# EAGLE design zinko (EAGLE 9.3.0)
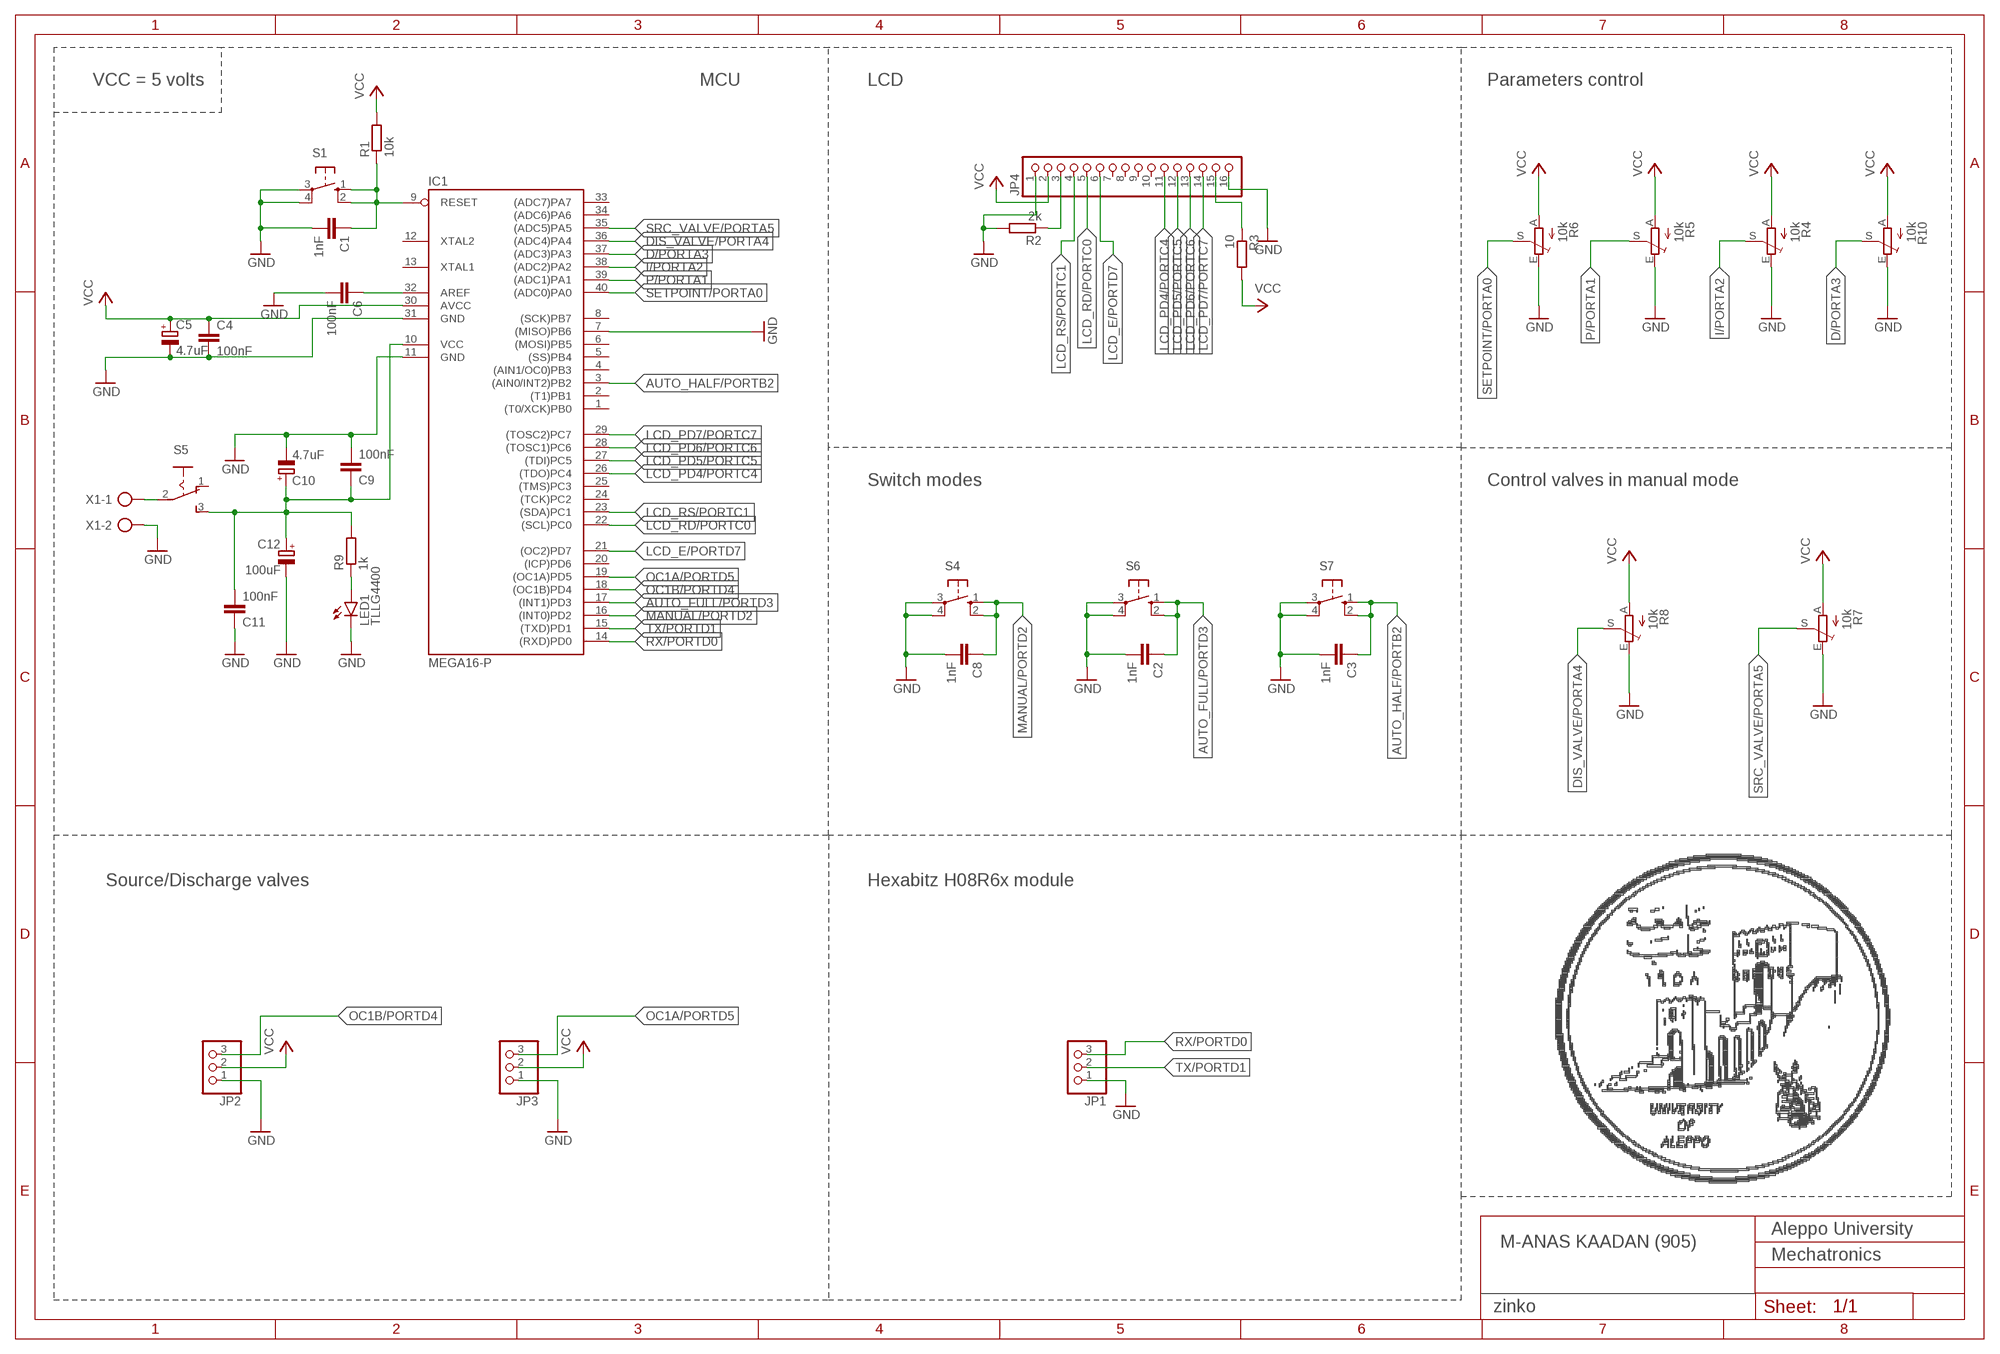
[diagram p0: schematic, sheet 1]

## Parts
C1  1nF  C-EU025-024X044  [C025-024X044]
C2  1nF  C-EU025-024X044  [C025-024X044]
C3  1nF  C-EU025-024X044  [C025-024X044]
C4  100nF  C-EU025-024X044  [C025-024X044]
C5  4.7uF  CPOL-EUE2,5-6E  [E2,5-6E]
C6  100nF  C-EU025-024X044  [C025-024X044]
C8  1nF  C-EU025-024X044  [C025-024X044]
C9  100nF  C-EU025-024X044  [C025-024X044]
C10  4.7uF  CPOL-EUB45181A  [B45181A]
C11  100nF  C-EU025-024X044  [C025-024X044]
C12  100uF  CPOL-EUB45181A  [B45181A]
IC1  MEGA16-P  [DIL40]
JP1  PINHD-1X3  [1X03]
JP2  PINHD-1X3  [1X03]
JP3  PINHD-1X3  [1X03]
JP4  PINHD-1X16  [1X16]
LED1  TLLG4400  [LED3MM]
R1  10k  R-EU_0204/7  [0204/7]
R2  2k  R-EU_0204/7  [0204/7]
R3  10  R-EU_0204/7  [0204/7]
R4  10k  TRIM_EU-RJ9W  [RJ9W]
R5  10k  TRIM_EU-RJ9W  [RJ9W]
R6  10k  TRIM_EU-RJ9W  [RJ9W]
R7  10k  TRIM_EU-RJ9W  [RJ9W]
R8  10k  TRIM_EU-RJ9W  [RJ9W]
R9  1k  R-EU_0204/7  [0204/7]
R10  10k  TRIM_EU-RJ9W  [RJ9W]
S1  10-XX  [B3F-10XX]
S4  10-XX  [B3F-10XX]
S5  255SB  [255SB]
S6  10-XX  [B3F-10XX]
S7  10-XX  [B3F-10XX]
X1  AK300/2  [AK300/2]

## Nets
AUTO_FULL/PORTD3: C2.1 IC1.17((INT1)PD3) S6.1(S) S6.2(S1)
AUTO_HALF/PORTB2: C3.1 IC1.3((AIN0/INT2)PB2) S7.1(S) S7.2(S1)
D/PORTA3: IC1.37((ADC3)PA3) R10.S
DIS_VALVE/PORTA4: IC1.36((ADC4)PA4) R8.S
GND: C1.2 C2.2 C3.2 C4.2 C5.- C6.2 C8.2 C9.2 C10.- C11.1 C12.- IC1.7((MISO)PB6) IC1.11(GND) IC1.31(GND) JP1.1 JP2.1 JP3.1 JP4.1 JP4.16 LED1.K(C) R2.2 R4.E R5.E R6.E R7.E R8.E R10.E S1.3(P) S1.4(P1) S4.3(P) S4.4(P1) S6.3(P) S6.4(P1) S7.3(P) S7.4(P1) X1.2
I/PORTA2: IC1.38((ADC2)PA2) R4.S
LCD_E/PORTD7: IC1.21((OC2)PD7) JP4.6
LCD_PD4/PORTC4: IC1.26((TDO)PC4) JP4.11
LCD_PD5/PORTC5: IC1.27((TDI)PC5) JP4.12
LCD_PD6/PORTC6: IC1.28((TOSC1)PC6) JP4.13
LCD_PD7/PORTC7: IC1.29((TOSC2)PC7) JP4.14
LCD_RD/PORTC0: IC1.22((SCL)PC0) JP4.5
LCD_RS/PORTC1: IC1.23((SDA)PC1) JP4.4
MANUAL/PORTD2: C8.1 IC1.16((INT0)PD2) S4.1(S) S4.2(S1)
N$1: C1.1 IC1.9(RESET) R1.1 S1.1(S) S1.2(S1)
N$2: JP4.15 R3.1
N$3: C6.1 IC1.32(AREF)
N$4: JP4.3 R2.1
N$26: S5.2(P) X1.1
N$28: LED1.A R9.1
OC1A/PORTD5: IC1.19((OC1A)PD5) JP3.3
OC1B/PORTD4: IC1.18((OC1B)PD4) JP2.3
P/PORTA1: IC1.39((ADC1)PA1) R5.S
RX/PORTD0: IC1.14((RXD)PD0) JP1.3
SETPOINT/PORTA0: IC1.40((ADC0)PA0) R6.S
SRC_VALVE/PORTA5: IC1.35((ADC5)PA5) R7.S
TX/PORTD1: IC1.15((TXD)PD1) JP1.2
VCC: C4.1 C5.+ C9.1 C10.+ C11.2 C12.+ IC1.10(VCC) IC1.30(AVCC) JP2.2 JP3.2 JP4.2 R1.2 R3.2 R4.A R5.A R6.A R7.A R8.A R9.2 R10.A S5.3(S)
Unconnected: IC1.1((T0/XCK)PB0) IC1.2((T1)PB1) IC1.4((AIN1/OC0)PB3) IC1.5((SS)PB4) IC1.6((MOSI)PB5) IC1.8((SCK)PB7) IC1.12(XTAL2) IC1.13(XTAL1) IC1.20((ICP)PD6) IC1.24((TCK)PC2) IC1.25((TMS)PC3) IC1.33((ADC7)PA7) IC1.34((ADC6)PA6) JP4.7 JP4.8 JP4.9 JP4.10 S5.1(O)

## Notes on the sheet
- VCC = 5 volts | MCU | LCD | Parameters control
- Switch modes | Control valves in manual mode
- Source/Discharge valves | Hexabitz H08R6x module
- Aleppo University
- M-ANAS KAADAN (905)
- Mechatronics

## Library data of the parts
C1-C4 C6 C8 = rcl:C-EU: CAPACITOR, European symbol; SPICEPREFIX: C
C5 = rcl:CPOL-EU: POLARIZED CAPACITOR, European symbol; SPICEPREFIX: C
C9 C11 = rcl@1:C-EU: CAPACITOR, European symbol
C10 C12 = rcl@1:CPOL-EU: POLARIZED CAPACITOR, European symbol
IC1 = atmel:MEGA16-P: MICROCONTROLLER 16 Kbytes FLASH 1 kbytes SRAM 512 bytes EEPROM USART 8-channel 10 bit ADC Source: avr.lbr; MPN: ATMEGA16-16PU; OC_FARNELL: 9171142; OC_NEWARK: 01M6885
JP1-JP3 = pinhead:PINHD-1X3: PIN HEADER
JP4 = pinhead:PINHD-1X16: PIN HEADER
LED1 = led:TLLG4400: Low Current (2mA) LED 3 mm Tinted Diffused Package color GREEN Source: Data sheet <http://www.farnell.com/datasheets/391098.pdf>; MF: VISHAY SEMICONDUCTOR; OC_FARNELL: 1612435
R1-R3 = rcl:R-EU_: RESISTOR, European symbol; SPICEPREFIX: R
R4-R8 R10 = pot:TRIM_EU-: POTENTIOMETER
R9 = rcl@1:R-EU_: RESISTOR, European symbol
S1 S4 S6 S7 = switch-omron:10-XX: OMRON SWITCH; MPN: B3F-1000; OC_FARNELL: 176432; OC_NEWARK: 36M3542
S5 = switch:255SB: SLIDING SWITCH Distributor Buerklin, 11G810
X1 = con-ptr500:AK300/2: CONNECTOR; OC_FARNELL: unknown; OC_NEWARK: unknown

## Board
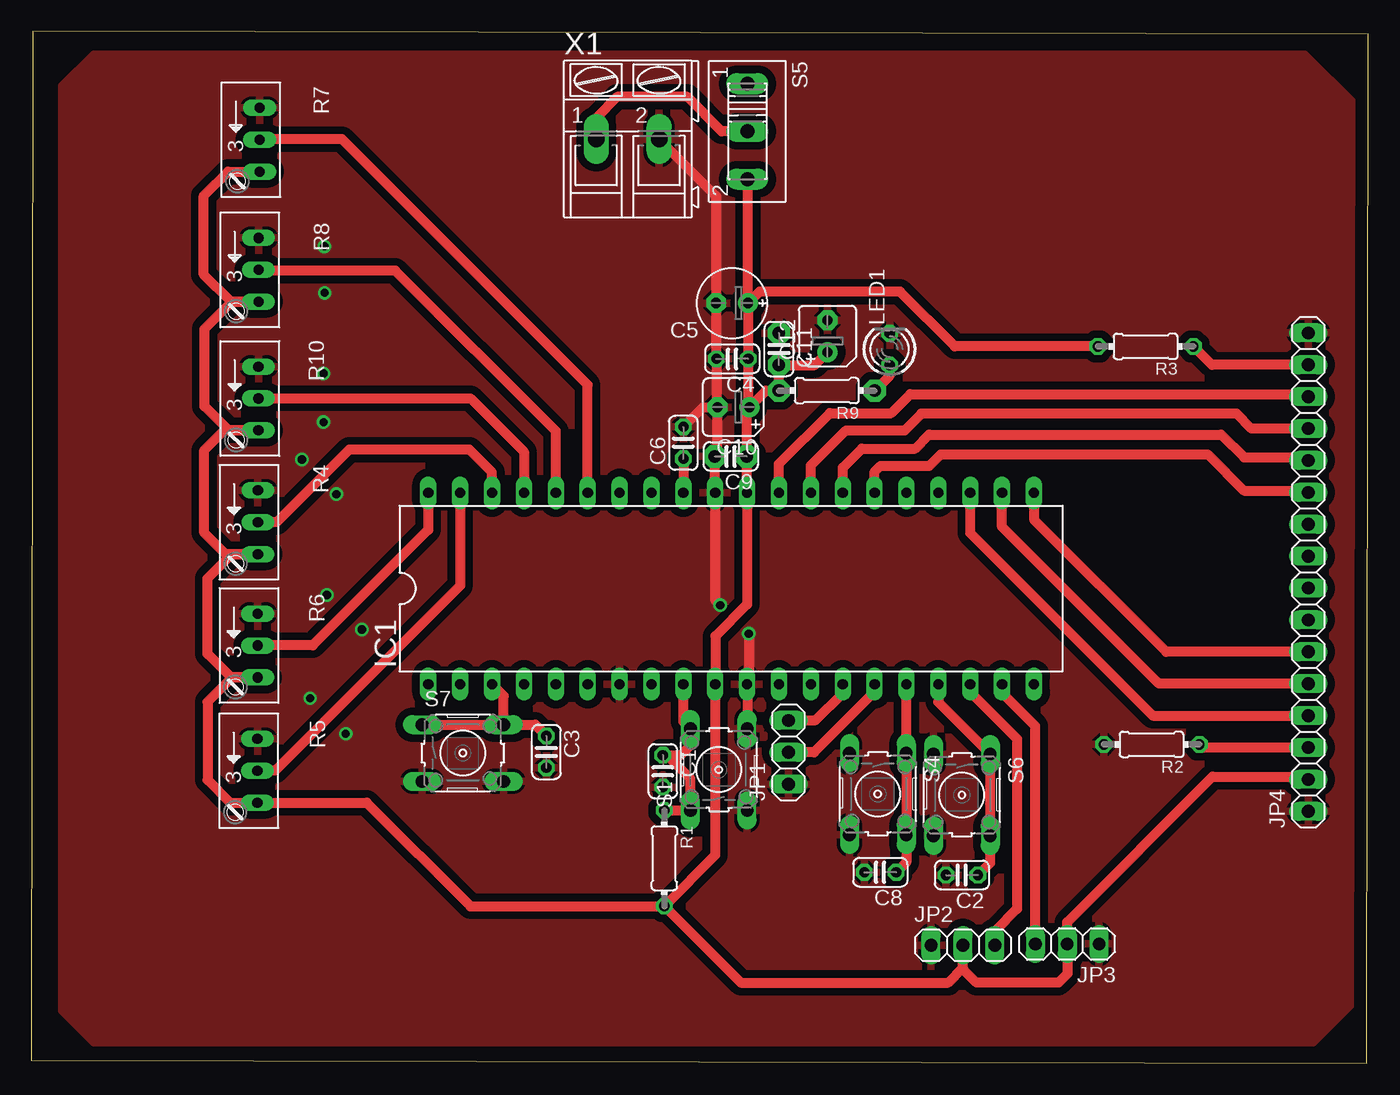
[diagram p1: board, top side]
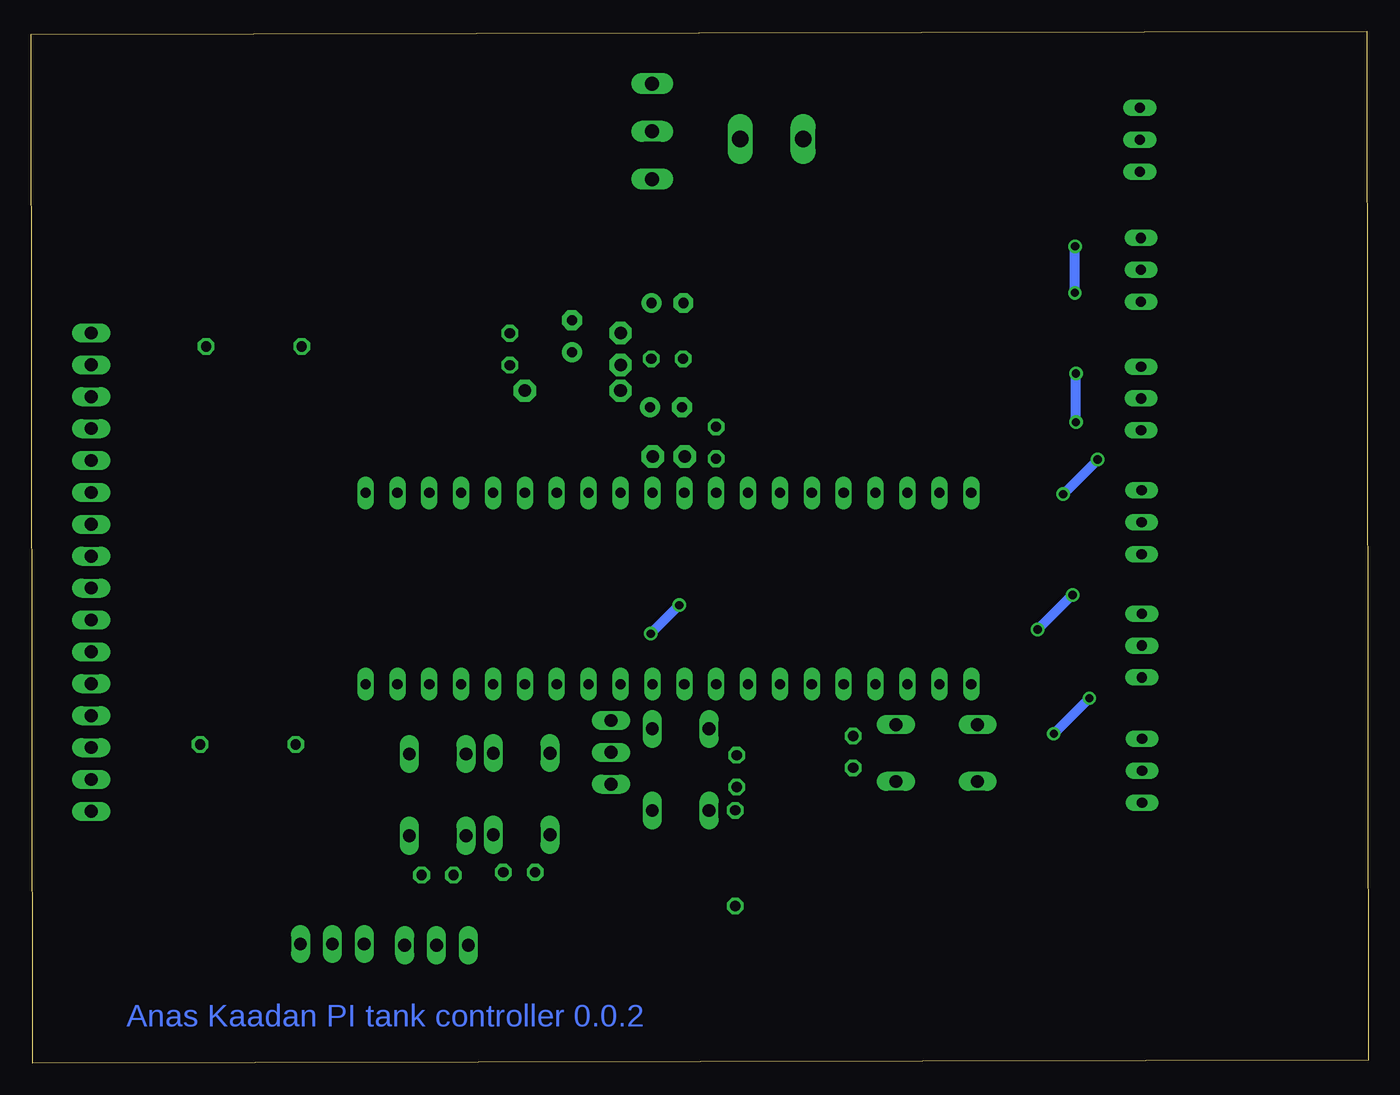
[diagram p2: board, bottom side, seen from below]

Size 106.5 x 82.17 mm. Coordinates in mm from the lower left corner, seen from the top.
Outline: 0,0.21 106.39,0 106.5,81.96 0.11,82.17 0,0.21
Copper layers (1*16): Top 0.035mm / dielectric 1.5mm / Bottom 0.035mm
Design rules "default *": minimum track width 6mil, minimum drill 0.35mm, track to track 6mil, track to pad 6mil, pad to pad 6mil, via to via 6mil, smd to smd 6mil, copper to edge 40mil, drill to drill 6mil, minimum pad ring 10mil, minimum via ring 8mil, stop-mask expansion 4mil, vias tented up to drill 0mil, thermal gap 10mil

### Footprints (pad centres in the part's own frame; a part is rotated, then mirrored left to right if it is on the bottom)
C025-024X044 = drill 0.813 octagon: 1 -1.27,0; 2 1.27,0
E2,5-6E = drill 0.813 pad 1.575: + -1.27,0 | drill 0.813 pad 1.575 octagon: - 1.27,0
C025-024X044' = drill 1 pad 1.778 octagon: 1 -1.27,0; 2 1.27,0
B45181A = drill 0.813 pad 1.6: + -1.27,0 | drill 0.813 pad 1.6 octagon: - 1.27,0
DIL40 = drill 0.813 long: 1 -24.13,-7.62; 2 -21.59,-7.62; 3 -19.05,-7.62; 4 -16.51,-7.62; 5 -13.97,-7.62; 6 -11.43,-7.62; 7 -8.89,-7.62; 8 -6.35,-7.62; 9 -3.81,-7.62; 10 -1.27,-7.62; 11 1.27,-7.62; 12 3.81,-7.62; 13 6.35,-7.62; 14 8.89,-7.62; 15 11.43,-7.62; 16 13.97,-7.62; 17 16.51,-7.62; 18 19.05,-7.62; 19 21.59,-7.62; 20 24.13,-7.62; 21 24.13,7.62; 22 21.59,7.62; 23 19.05,7.62; 24 16.51,7.62; 25 13.97,7.62; 26 11.43,7.62; 27 8.89,7.62; 28 6.35,7.62; 29 3.81,7.62; 30 1.27,7.62; 31 -1.27,7.62; 32 -3.81,7.62; 33 -6.35,7.62; 34 -8.89,7.62; 35 -11.43,7.62; 36 -13.97,7.62; 37 -16.51,7.62; 38 -19.05,7.62; 39 -21.59,7.62; 40 -24.13,7.62
1X03 = drill 1.016 long: 1 -2.54,0; 2 0,0; 3 2.54,0
1X16 = drill 1.016 long: 1 -19.05,0; 2 -16.51,0; 3 -13.97,0; 4 -11.43,0; 5 -8.89,0; 6 -6.35,0; 7 -3.81,0; 8 -1.27,0; 9 1.27,0; 10 3.81,0; 11 6.35,0; 12 8.89,0; 13 11.43,0; 14 13.97,0; 15 16.51,0; 16 19.05,0
LED3MM = drill 0.813 octagon: A -1.27,0; K 1.27,0
0204/7 = drill 0.813 octagon: 1 -3.81,0; 2 3.81,0
RJ9W = drill 0.813 long: A 2.54,0.635; E -2.54,0.635; S 0,0.635
0204/7' = drill 1 pad 1.778 octagon: 1 -3.81,0; 2 3.81,0
B3F-10XX = drill 1.016 long: 1 -3.251,2.261; 2 3.251,2.261; 3 -3.251,-2.261; 4 3.251,-2.261
255SB = drill 1.118 long: 1 -3.81,0; 2 0,0; 3 3.81,0
AK300/2 = drill 1.321 long: 1 -2.515,0; 2 2.489,0

### Placement (x,y rotation side)
C1  50.31,23.26 270 top
C2  74.14,14.98 180 top
C3  41.03,24.79 270 top
C4  55.84,56.1 180 top
C5  55.83,60.54 180 top
C6  51.95,49.41 90 top
C8  67.64,15.2 180 top
C9  100nF  [C025-024X044']  55.73,48.32 180 top
C10  55.94,52.25 180 top
C11  100nF  [C025-024X044']  59.56,56.87 270 top
C12  63.43,57.9 90 top
IC1  55.75,37.8 0 top
JP1  60.32,24.76 90 top
JP2  74.22,9.39 0 top
JP3  82.52,9.49 180 top
JP4  101.73,39.11 90 top
LED1  68.38,56.86 90 top
R1  50.43,16.32 270 top
R2  89.25,25.38 180 top
R3  88.77,57.08 180 top
R4  17.41,43.08 270 top
R5  17.38,23.29 270 top
R6  17.4,33.26 270 top
R7  17.55,73.54 270 top
R8  17.46,63.18 270 top
R9  1k  [0204/7']  63.37,53.56 180 top
R10  17.46,52.94 270 top
S1  54.77,23.38 90 top
S4  67.44,21.44 270 top
S5  57.05,74.21 270 top
S6  74.13,21.37 270 top
S7  34.37,24.7 0 top
X1  47.52,73.6 0 top

### Tracks (layer width: path | path; a pad name or v marks a point on that pad's centre or on a via)
AUTO_FULL/PORTD3
  Top 0.813: IC1.17 72.26,28.75 S6.1 S6.2 76.39,15.96 C2.1
AUTO_HALF/PORTB2
  Top 0.813: S7.1 S7.2 | S7.2 37.62,29.26 IC1.3 | S7.2 40.13,26.96 C3.1
D/PORTA3
  Top 0.813: R10.S 34.98,52.94 39.24,48.68 IC1.37
DIS_VALVE/PORTA4
  Top 0.813: IC1.36 41.78,50.33 28.99,63.12 18.16,63.12 R8.S
GND  (via drill 0.65)
  Top 0.813: C6.2 53.52,52.25 C10.- | C10.- 54.67,48.54 C9.2 54.48,48.3 IC1.31 54.48,36.89 v54.89,36.48 | 57.08,30.24 IC1.11 | S1.4 57.08,26.67 57.08,30.24 | X1.2 54.56,69.05 C5.- 54.56,56.11 C4.2 54.57,52.34 C10.- | v57.15,34.21 57.15,30.31 57.08,30.24
  Bottom 0.813: v54.89,36.48 v57.15,34.21 | v25.05,26.23 22.21,29.07 v22.21,29.07 | v26.34,34.53 23.59,37.28 v23.54,37.28 | v24.3,45.32 v21.55,48.07 | v23.27,51.05 v23.27,54.92 | v23.37,61.35 23.37,65.02 v23.35,65.05
  pour Top (isolate 0.61): 4.95,80.37 101.47,80.37 105.45,76.39 105.45,4.95 102.12,1.63 4.95,1.63 2.41,4.17 2.41,77.83
I/PORTA2
  Top 0.813: IC1.38 36.7,47.06 34.9,48.86 25.32,48.86 19.54,43.08 R4.S
LCD_E/PORTD7
  Top 0.813: JP4.6 90.42,32.76 79.88,43.29 IC1.21
LCD_PD4/PORTC4
  Top 0.813: JP4.11 101.59,45.6 96.6,45.6 93.72,48.48 72.45,48.48 71.53,47.57 67.66,47.57 67.18,47.09 IC1.26
LCD_PD5/PORTC5
  Top 0.813: IC1.27 64.64,47.44 66.16,48.95 70.42,48.95 71.52,50.06 94.8,50.06 96.62,48.24 101.5,48.24 JP4.12
LCD_PD6/PORTC6
  Top 0.813: IC1.28 62.1,47.6 64.9,50.4 69.59,50.4 70.91,51.72 96.03,51.72 97.21,50.54 JP4.13
LCD_PD7/PORTC7
  Top 0.813: IC1.29 59.56,47.73 63.61,51.78 68.51,51.78 70.02,53.29 101.53,53.29 JP4.14
LCD_RD/PORTC0
  Top 0.813: JP4.5 89.84,30.22 77.34,42.72 IC1.22
LCD_RS/PORTC1
  Top 0.813: JP4.4 89.33,27.68 74.8,42.21 IC1.23
MANUAL/PORTD2
  Top 0.813: IC1.16 69.7,30.16 S4.1 S4.2 69.7,15.99 C8.1
N$1
  Top 0.813: IC1.9 51.94,27.19 S1.2 52.44,26.56 52.56,26.44 52.56,25.36 51.73,24.53 C1.1 50.64,24.53 52.51,22.66 S1.1 52.5,20.13 R1.1
N$2
  Top 0.813: JP4.15 94.05,55.62 R3.1
N$3
  Top 0.813: C6.1 IC1.32
N$4
  Top 0.813: JP4.3 93.3,25.14 R2.1
N$26
  Top 0.813: S5.2 55,74.21 52.26,76.95 46.67,76.95 45.01,75.29 X1.1
N$28
  Top 0.813: R9.1 68.38,54.76 LED1.A
OC1A/PORTD5
  Top 0.813: JP3.3 79.98,26.85 77.34,29.49 IC1.19
OC1B/PORTD4
  Top 0.813: IC1.18 74.8,29.55 78.52,25.83 78.52,12.28 76.76,10.52 JP2.3
P/PORTA1
  Top 0.813: IC1.39 34.16,38.04 19.42,23.29 R5.S
RX/PORTD0
  Top 0.813: JP1.3 60.34,27.32 62.48,27.32 64.64,29.48 IC1.14
SETPOINT/PORTA0
  Top 0.813: IC1.40 31.62,42.48 22.42,33.28 18.06,33.28 R6.S
SRC_VALVE/PORTA5
  Top 0.813: IC1.35 44.32,54.02 24.74,73.6 18.25,73.6 R7.S
TX/PORTD1
  Top 0.813: IC1.15 67.18,29.58 62.36,24.76 JP1.2
VCC
  Top 0.813: C10.+ 56.99,52.03 C9.1 57.02,48.3 IC1.30 57.02,36.54 54.5,34.01 54.5,30.2 IC1.10 54.48,16.57 R1.2 | C12.+ 62.41,55.6 C11.2 R9.2 58.52,53.56 C10.+ | C10.+ 57.11,52.34 C4.1 57.11,60.52 C5.+ | C5.+ 57.1,70.35 S5.3 | R3.2 73.57,57.08 69.2,61.45 58.01,61.45 C5.+ | JP4.2 101.52,22.81 94.1,22.81 82.52,11.24 JP3.2 82.56,9.45 82.56,7.15 81.83,6.42 75.3,6.42 74.22,7.5 JP2.2 74.22,7.59 73.05,6.42 56.52,6.42 R1.2 | R7.A 15.66,71 13.74,69.09 13.74,62.81 15.9,60.64 R8.A 15.97,60.64 13.8,58.48 13.8,52.31 15.72,50.4 R10.A 15.36,50.4 13.79,48.83 13.79,42.23 15.47,40.54 R4.A 15.97,40.54 14.04,38.62 14.04,32.6 15.92,30.72 R6.A 15.99,30.72 14.04,28.77 14.04,22.57 15.85,20.75 R5.A 26.72,20.75 34.99,12.48 50.39,12.48 R1.2

### Text on the board
Bottom: Anas Kaadan PI tank controller 0.0.2